# Altium schematic sheet Sheet_12085BUZZER.schdoc
size 50 x 38 mm
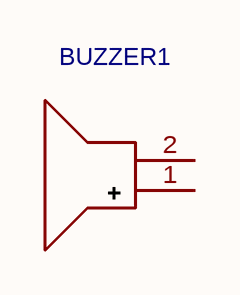
[diagram p0: Sheet_12085BUZZER.schdoc]

## Parts
BUZZER1  (no value)  [BUZ-TH_BD12.0-P6.50-D0.6_SEA-1285F]

## Nets

Not connected (* = marked no-connect by the designer): BUZZER1 1(+) 2(-)

## Library data of the parts
BUZZER1 = (no symbol name): Contributor: LCSC; BOM_Supplier: LCSC; BOM_Supplier Part: C2693577; BOM_JLCPCB Part Class: Extended Part; spicePre: B